# EAGLE design sample_holder (EAGLE 9.3.0)
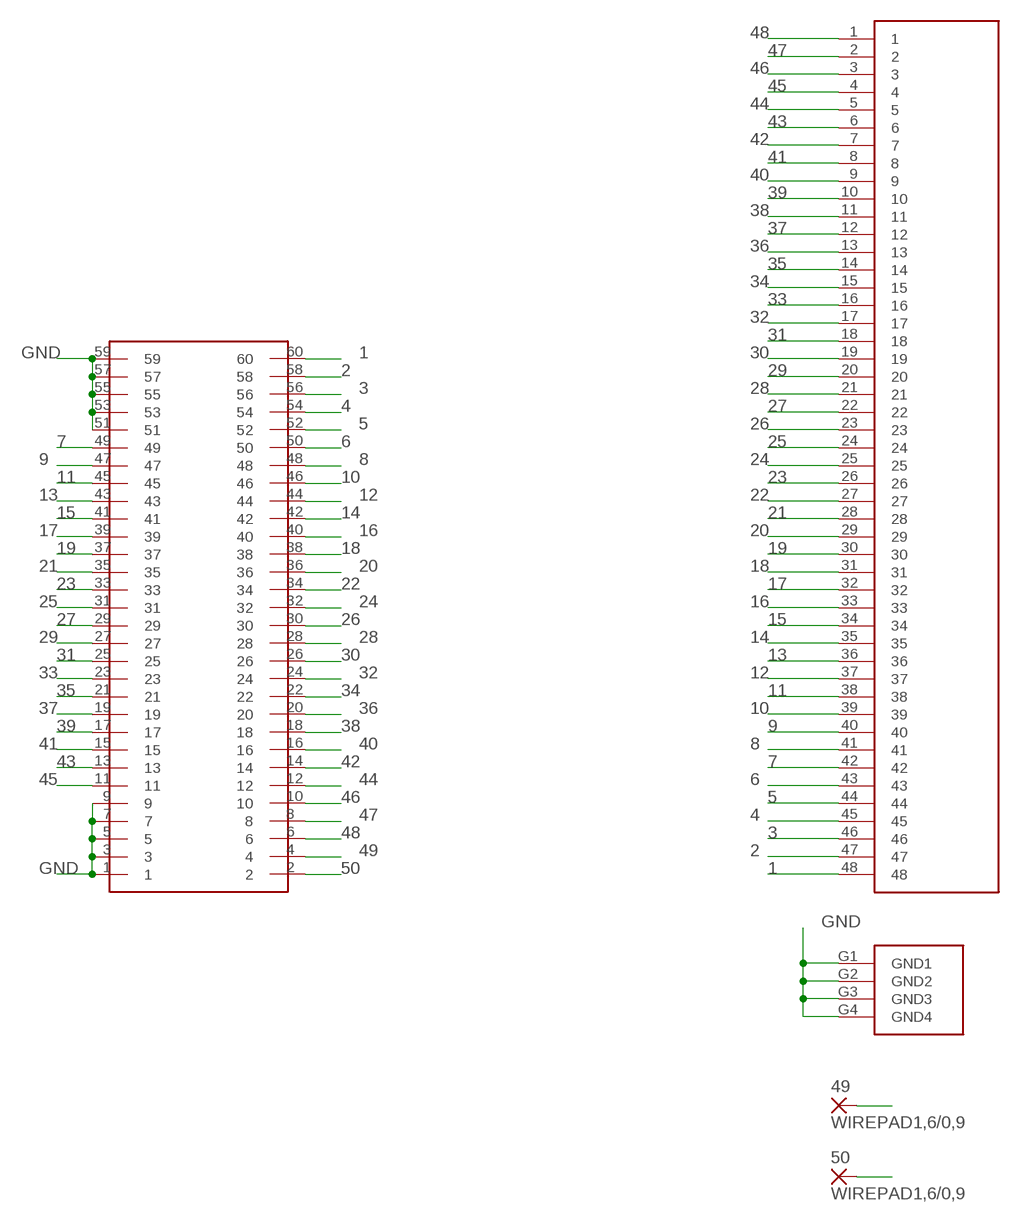
[diagram p0: schematic, sheet 1]

## Parts
49  WIREPAD1,6/0,9  [1,6/0,9]
50  WIREPAD1,6/0,9  [1,6/0,9]
U$1  MEC5-030-CARD-ALL  [MEC-030-CARD-ALL]
U$2  FOLKLAB-48PADS  [FOLKLAB-48PADS]

## Nets
1: U$1.60 U$2.48
2: U$1.58 U$2.47
3: U$1.56 U$2.46
4: U$1.54 U$2.45
5: U$1.52 U$2.44
6: U$1.50 U$2.43
7: U$1.49 U$2.42
8: U$1.48 U$2.41
9: U$1.47 U$2.40
10: U$1.46 U$2.39
11: U$1.45 U$2.38
12: U$1.44 U$2.37
13: U$1.43 U$2.36
14: U$1.42 U$2.35
15: U$1.41 U$2.34
16: U$1.40 U$2.33
17: U$1.39 U$2.32
18: U$1.38 U$2.31
19: U$1.37 U$2.30
20: U$1.36 U$2.29
21: U$1.35 U$2.28
22: U$1.34 U$2.27
23: U$1.33 U$2.26
24: U$1.32 U$2.25
25: U$1.31 U$2.24
26: U$1.30 U$2.23
27: U$1.29 U$2.22
28: U$1.28 U$2.21
29: U$1.27 U$2.20
30: U$1.26 U$2.19
31: U$1.25 U$2.18
32: U$1.24 U$2.17
33: U$1.23 U$2.16
34: U$1.22 U$2.15
35: U$1.21 U$2.14
36: U$1.20 U$2.13
37: U$1.19 U$2.12
38: U$1.18 U$2.11
39: U$1.17 U$2.10
40: U$1.16 U$2.9
41: U$1.15 U$2.8
42: U$1.14 U$2.7
43: U$1.13 U$2.6
44: U$1.12 U$2.5
45: U$1.11 U$2.4
46: U$1.10 U$2.3
47: U$1.8 U$2.2
48: U$1.6 U$2.1
49: 49.1(P) U$1.4
50: 50.1(P) U$1.2
GND: U$1.1 U$1.3 U$1.5 U$1.7 U$1.9 U$1.51 U$1.53 U$1.55 U$1.57 U$1.59 U$2.G1(GND1) U$2.G2(GND2) U$2.G3(GND3) U$2.G4(GND4)

## Library data of the parts
49 50 = wirepad:WIREPAD: Wire PAD connect wire on PCB
U$1 = MEC5-030-01-L-RA-CARD:MEC5-030-CARD-ALL
U$2 = FolkLab-48pads:FOLKLAB-48PADS

## Net classes
0 default: width 0.152 mm, clearance 0.152 mm

## Board
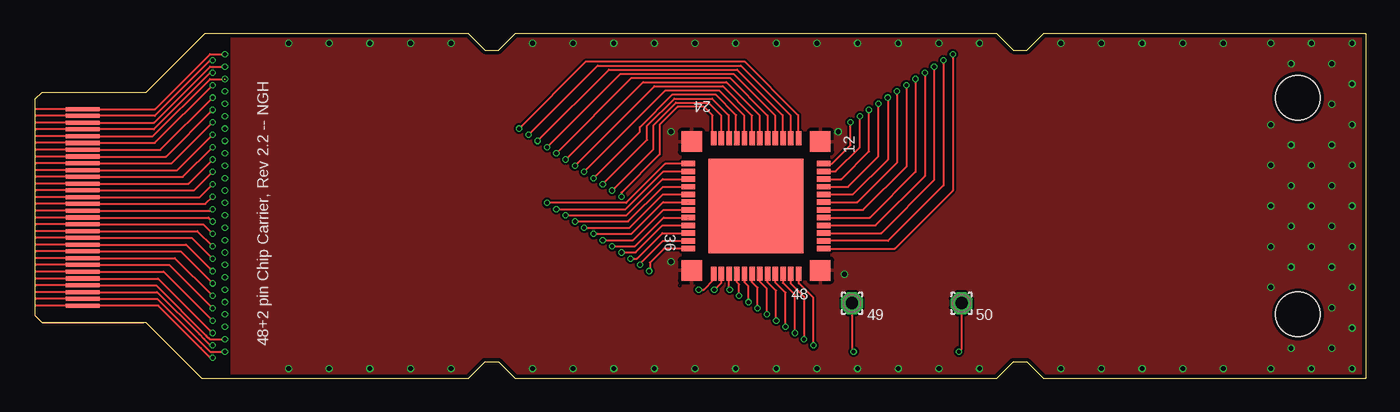
[diagram p1: board, top side]
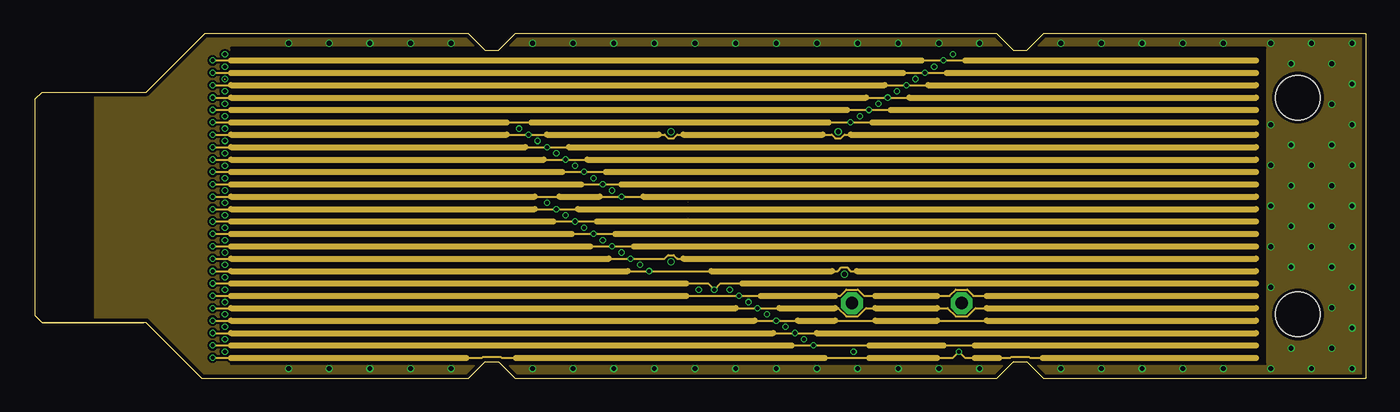
[diagram p2: board, inner layer Route2]
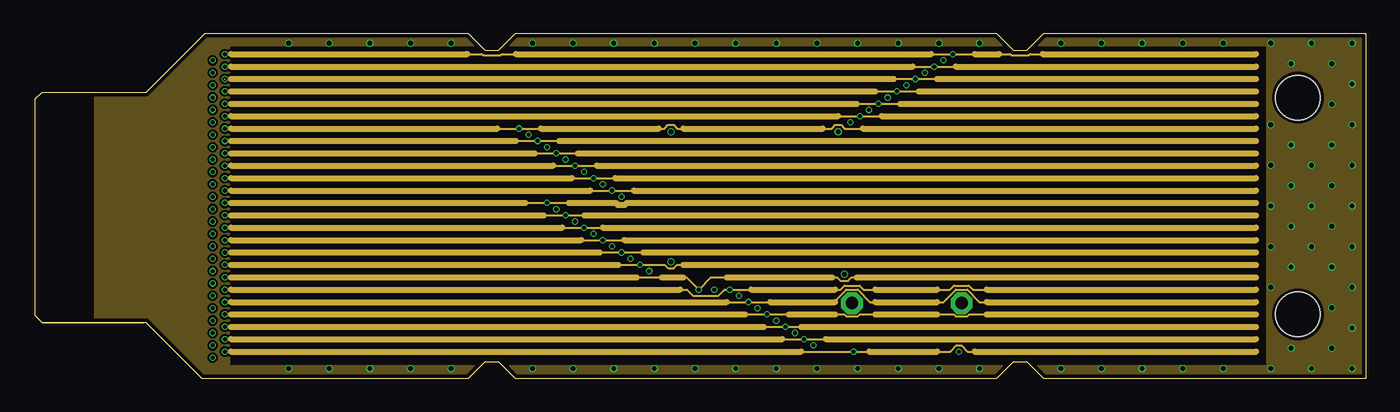
[diagram p3: board, inner layer Route15]
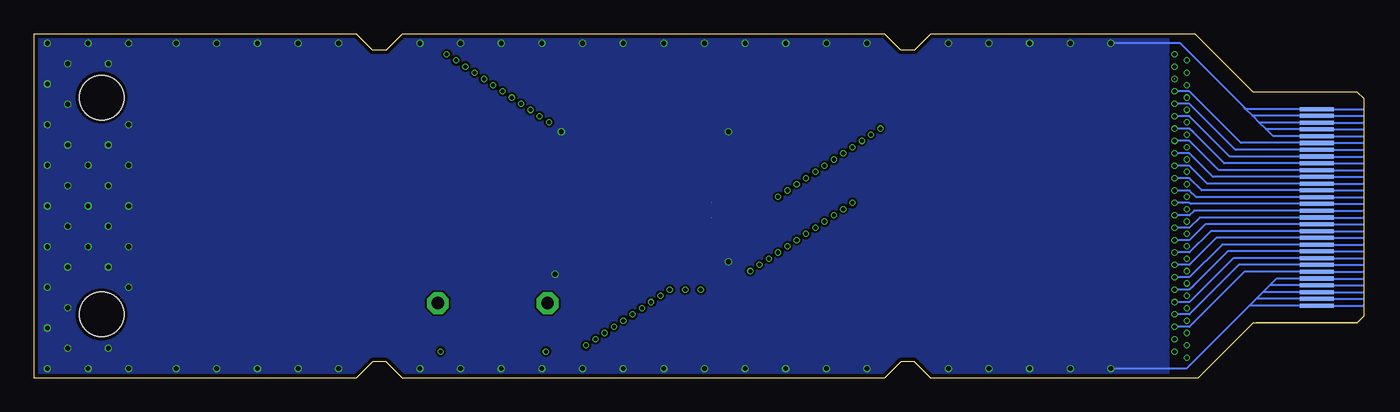
[diagram p4: board, bottom side, seen from below]

Size 98.2 x 25.4 mm. Coordinates in mm from the lower left corner, seen from the top.
Outline: 98.2,25.4 98.2,0 74.4,0 73.2,1.2 72.2,1.2 71,0 35.4,0 34.2,1.2 33.2,1.2 32,0 12.3,0 8.2,4.1 0.5,4.1 0,4.6 0,20.6 0.5,21.1 8.2,21.1 12.5,25.4 32,25.4 33.2,24.2 34.2,24.2 35.4,25.4 71,25.4 72.2,24.2 73.2,24.2 74.4,25.4 98.2,25.4
Copper layers ((1*2)+(15*16)): Top 0.035mm / dielectric 0.2mm / Route2 0.035mm / dielectric 0.4mm / Route15 0.035mm / dielectric 0.2mm / Bottom 0.035mm
Design rules "default *": minimum track width 6mil, minimum drill 10mil, track to track 6mil, track to pad 6mil, pad to pad 6mil, via to via 6mil, smd to smd 6mil, copper to edge 10mil, drill to drill 10mil, minimum pad ring 5mil, minimum via ring 3mil, stop-mask expansion 4mil, vias tented up to drill 12mil, thermal gap 10mil
Holes 3.3 mm at 93.2,4.7 93.2,20.7

### Footprints (pad centres in the part's own frame; a part is rotated, then mirrored left to right if it is on the bottom)
1,6/0,9 = drill 0.914 pad 1.6 octagon: 1 0,0
MEC-030-CARD-ALL = smd 0.3 x 2.5 bottom: 1 -7.25,-3.5; 3 -6.75,-3.5; 5 -6.25,-3.5; 7 -5.75,-3.5; 9 -5.25,-3.5; 11 -4.75,-3.5; 13 -4.25,-3.5; 15 -3.75,-3.5; 17 -3.25,-3.5; 19 -2.75,-3.5; 21 -2.25,-3.5; 23 -1.75,-3.5; 25 -1.25,-3.5; 27 -0.75,-3.5; 29 -0.25,-3.5; 31 0.25,-3.5; 33 0.75,-3.5; 35 1.25,-3.5; 37 1.75,-3.5; 39 2.25,-3.5; 41 2.75,-3.5; 43 3.25,-3.5; 45 3.75,-3.5; 47 4.25,-3.5; 49 4.75,-3.5; 51 5.25,-3.5; 53 5.75,-3.5; 55 6.25,-3.5; 57 6.75,-3.5; 59 7.25,-3.5 | smd 0.3 x 2.5: 2 -7.25,-3.5; 4 -6.75,-3.5; 6 -6.25,-3.5; 8 -5.75,-3.5; 10 -5.25,-3.5; 12 -4.75,-3.5; 14 -4.25,-3.5; 16 -3.75,-3.5; 18 -3.25,-3.5; 20 -2.75,-3.5; 22 -2.25,-3.5; 24 -1.75,-3.5; 26 -1.25,-3.5; 28 -0.75,-3.5; 30 -0.25,-3.5; 32 0.25,-3.5; 34 0.75,-3.5; 36 1.25,-3.5; 38 1.75,-3.5; 40 2.25,-3.5; 42 2.75,-3.5; 44 3.25,-3.5; 46 3.75,-3.5; 48 4.25,-3.5; 50 4.75,-3.5; 52 5.25,-3.5; 54 5.75,-3.5; 56 6.25,-3.5; 58 6.75,-3.5; 60 7.25,-3.5
FOLKLAB-48PADS = smd 7 x 7: 0 0,0 | smd 1 x 0.4: 1 -5,-3.14; 2 -5,-2.57; 3 -5,-2; 4 -5,-1.43; 5 -5,-0.86; 6 -5,-0.29; 7 -5,0.28; 8 -5,0.85; 9 -5,1.42; 10 -5,1.99; 11 -5,2.56; 12 -5,3.13; 25 5,3.13; 26 5,2.56; 27 5,1.99; 28 5,1.42; 29 5,0.85; 30 5,0.28; 31 5,-0.29; 32 5,-0.86; 33 5,-1.43; 34 5,-2; 35 5,-2.57; 36 5,-3.14 | smd 0.4 x 1: 13 -3.14,5; 14 -2.57,5; 15 -2,5; 16 -1.43,5; 17 -0.86,5; 18 -0.29,5; 19 0.28,5; 20 0.85,5; 21 1.42,5; 22 1.99,5; 23 2.56,5; 24 3.13,5; 37 3.13,-5; 38 2.56,-5; 39 1.99,-5; 40 1.42,-5; 41 0.85,-5; 42 0.28,-5; 43 -0.29,-5; 44 -0.86,-5; 45 -1.43,-5; 46 -2,-5; 47 -2.57,-5; 48 -3.14,-5 | smd 1.5 x 1.5: G1 -4.75,-4.75; G2 -4.75,4.75; G3 4.75,4.75; G4 4.75,-4.75

### Placement (x,y rotation side)
49  60.29,5.53 0 top
50  68.37,5.53 0 top
U$1  0,12.6 90 top
U$2  53.2,12.7 90 top

### Tracks (layer width: path | path; a pad name or v marks a point on that pad's centre or on a via)
1  (via drill 0.3 pad 0.08)
  Top 0.152: v14,23.9 12.9,23.9 8.85,19.85 U$1.60 | U$2.48 63.44,9.56 67.72,13.84 v67.72,23.9
  Route15 0.152: v14,23.9 14.46,23.9 | 14.46,23.9 | 66.12,23.9 v67.72,23.9 69.32,23.9 | 31.83,23.9 32.98,23.9 33.05,23.83 34.35,23.83 34.42,23.9 35.49,23.9 | 71.15,23.9 71.98,23.9 72.05,23.83 73.35,23.83 73.42,23.9 74.35,23.9
  Route15 0.457: 14.46,23.9 31.83,23.9 31.91,23.9 | 35.49,23.9 66.12,23.9 | 69.32,23.9 71.15,23.9 | 74.35,23.9 90.12,23.9
2  (via drill 0.3 pad 0.08)
  Top 0.152: U$2.47 62.94,10.13 67.04,14.22 v67.04,23.44 | U$1.58 8.83,19.35 12.93,23.44 v13.09,23.44
  Route2 0.152: v13.09,23.44 14.46,23.44 | 65.44,23.44 v67.04,23.44 68.64,23.44
  Route2 0.457: 14.46,23.44 65.44,23.44 | 68.64,23.44 90.12,23.44
3  (via drill 0.3 pad 0.08)
  Top 0.152: v14,22.99 v14,22.98 12.9,22.98 8.76,18.85 U$1.56 | U$2.46 62.45,10.7 66.35,14.6 v66.35,22.99
  Route15 0.152: v14,22.99 14.46,22.99 | 64.75,22.99 v66.35,22.99 67.95,22.99
  Route15 0.457: 14.46,22.99 64.75,22.99 | 67.95,22.99 90.12,22.99
4  (via drill 0.3 pad 0.08)
  Top 0.152: U$2.45 62.03,11.27 65.67,14.91 v65.67,22.53 | U$1.54 8.75,18.35 12.93,22.53 v13.09,22.53
  Route2 0.152: v13.09,22.53 14.46,22.53 | 64.06,22.53 v65.67,22.53 67.27,22.53
  Route2 0.457: 14.46,22.53 64.06,22.53 | 67.27,22.53 90.12,22.53
5  (via drill 0.3 pad 0.08)  (1 unrouted)
  Top 0.152: v14,22.07 12.9,22.07 8.68,17.85 U$1.52 | U$2.44 61.61,11.84 64.98,15.21 v64.98,22.07
  Route15 0.152: v14,22.07 14.46,22.07 | 63.38,22.07 v64.98,22.07 66.58,22.07
  Route15 0.457: 14.46,22.07 63.38,22.07 | 66.58,22.07 90.12,22.07
6  (via drill 0.3 pad 0.08)
  Top 0.152: U$2.43 61.11,12.41 64.29,15.6 v64.29,21.61 | U$1.50 8.82,17.35 v13.09,21.61
  Route2 0.152: v13.09,21.61 14.46,21.61 | 62.69,21.61 v64.29,21.61 65.89,21.61
  Route2 0.457: 14.46,21.61 62.69,21.61 | 65.89,21.61 90.12,21.61
7  (via drill 0.3 pad 0.08)
  Top 0.152: U$2.42 60.69,12.98 63.61,15.9 v63.61,21.16
  Route15 0.152: v14,21.16 14.46,21.16 | 62.01,21.16 v63.61,21.16 65.21,21.16
  Route15 0.457: 14.46,21.16 62.01,21.16 | 65.21,21.16 90.12,21.16
  Bottom 0.152: v14,21.16 12.9,21.16 12.63,20.89 9.09,17.35 U$1.49
8  (via drill 0.3 pad 0.08)
  Top 0.152: U$2.41 60.34,13.55 62.92,16.13 v62.92,20.7 | U$1.48 9.24,16.85 v13.09,20.7
  Route2 0.152: v13.09,20.7 14.46,20.7 | 61.32,20.7 v62.92,20.7 64.52,20.7
  Route2 0.457: 14.46,20.7 61.32,20.7 | 64.52,20.7 90.12,20.7
9  (via drill 0.3 pad 0.08)
  Top 0.152: U$2.40 60,14.12 62.24,16.36 v62.24,20.24
  Route15 0.152: v14,20.24 14.46,20.24 | 60.64,20.24 v62.24,20.24 63.84,20.24
  Route15 0.457: 14.46,20.24 60.64,20.24 | 63.84,20.24 90.12,20.24
  Bottom 0.152: v14,20.24 12.9,20.24 9.51,16.85 U$1.47
10  (via drill 0.3 pad 0.08)
  Top 0.152: U$2.39 59.5,14.69 61.55,16.74 v61.55,19.79 | U$1.46 9.65,16.35 v13.09,19.79
  Route2 0.152: v13.09,19.79 14.46,19.79 | 59.95,19.79 v61.55,19.79 63.15,19.79
  Route2 0.457: 14.46,19.79 59.95,19.79 | 63.15,19.79 90.12,19.79
11  (via drill 0.3 pad 0.08)
  Top 0.152: U$2.38 59.08,15.26 60.87,17.04 v60.87,19.33
  Route15 0.152: v14,19.33 14.46,19.33 | 59.26,19.33 v60.87,19.33 62.47,19.33
  Route15 0.457: 14.46,19.33 59.26,19.33 | 62.47,19.33 90.12,19.33
  Bottom 0.152: v14,19.33 12.9,19.33 9.92,16.35 U$1.45
12  (via drill 0.3 pad 0.08)
  Top 0.152: U$2.37 58.81,15.83 60.18,17.2 v60.18,18.87 | U$1.44 10.06,15.85 v13.09,18.87
  Route2 0.152: v13.09,18.87 14.46,18.87 | 34.8,18.87 36.63,18.87 | 58.58,18.87 v60.18,18.87 61.78,18.87
  Route2 0.457: 14.46,18.87 34.8,18.87 | 36.63,18.87 58.58,18.87 | 61.78,18.87 90.12,18.87
13  (via drill 0.3 pad 0.08)
  Top 0.152: v35.72,18.41 40.67,23.37 52.34,23.37 56.3,19.41 56.3,17.74 U$2.36
  Route15 0.152: v14,18.41 14.46,18.41 | 34.12,18.41 v35.72,18.41 37.32,18.41 | 46.01,18.41 46.45,18.41 46.72,18.68 47.12,18.68 47.39,18.41 47.83,18.41 | 58.12,18.41 58.8,18.41 59.06,18.68 59.47,18.68 59.73,18.41 61.09,18.41
  Route15 0.457: 14.46,18.41 34.12,18.41 | 37.32,18.41 46.01,18.41 | 47.83,18.41 58.12,18.41 | 61.09,18.41 90.12,18.41
  Bottom 0.152: v14,18.41 12.9,18.41 12.63,18.15 12.63,18.14 10.34,15.85 U$1.43
14  (via drill 0.3 pad 0.08)
  Top 0.152: v36.4,17.96 41.51,23.06 52.07,23.06 55.73,19.41 55.73,17.74 U$2.35 | U$1.42 10.48,15.35 v13.09,17.96
  Route2 0.152: v13.09,17.96 14.46,17.96 | 34.8,17.96 v36.4,17.96 37.78,17.96 38.01,17.96 | 46.01,17.96 46.45,17.96 46.72,17.7 47.12,17.7 47.39,17.96 47.83,17.96 | 58.12,17.96 58.8,17.96 59.06,17.7 59.47,17.7 59.73,17.96 60.18,17.96
  Route2 0.457: 14.46,17.96 34.8,17.96 | 37.78,17.96 46.01,17.96 | 47.83,17.96 58.12,17.96 | 60.18,17.96 90.12,17.96
15  (via drill 0.3 pad 0.08)
  Top 0.152: v37.09,17.5 42.35,22.76 51.81,22.76 55.16,19.41 55.16,17.74 U$2.34
  Top 0.203: U$2.34 55.24,17.74
  Route15 0.152: v14,17.5 14.46,17.5 | 35.49,17.5 v37.09,17.5 38.69,17.5
  Route15 0.457: 14.46,17.5 35.49,17.5 | 38.69,17.5 90.12,17.5
  Bottom 0.152: v14,17.5 12.9,17.5 12.63,17.23 10.75,15.35 U$1.41
16  (via drill 0.3 pad 0.08)
  Top 0.152: v37.78,17.04 43.19,22.45 51.54,22.45 54.59,19.41 54.59,17.74 U$2.33 | U$1.40 10.89,14.85 v13.09,17.04
  Route2 0.152: v13.09,17.04 14.46,17.04 | 36.18,17.04 v37.78,17.04 39.38,17.04
  Route2 0.457: 14.46,17.04 36.18,17.04 | 39.38,17.04 90.12,17.04
17  (via drill 0.3 pad 0.08)
  Top 0.152: v38.46,16.59 44.02,22.15 51.28,22.15 54.06,19.37 U$2.32
  Route15 0.152: v14,16.59 14.46,16.59 | 36.86,16.59 v38.46,16.59 40.06,16.59
  Route15 0.457: 14.46,16.59 36.86,16.59 | 40.06,16.59 90.12,16.59
  Bottom 0.152: v14,16.59 v14,16.58 12.9,16.58 11.16,14.85 U$1.39
18  (via drill 0.3 pad 0.08)
  Top 0.152: v39.15,16.13 44.86,21.84 51.01,21.84 53.45,19.41 53.45,17.74 U$2.31 | U$1.38 11.31,14.35 v13.09,16.13
  Route2 0.152: v13.09,16.13 14.46,16.13 | 37.55,16.13 v39.15,16.13 40.75,16.13
  Route2 0.457: 14.46,16.13 37.55,16.13 | 40.75,16.13 90.12,16.13
19  (via drill 0.3 pad 0.08)
  Top 0.152: v39.83,15.67 45.7,21.54 50.75,21.54 52.92,19.37 U$2.30
  Route15 0.152: v14,15.67 14.46,15.67 | 38.23,15.67 v39.83,15.67 41.43,15.67
  Route15 0.457: 14.46,15.67 38.23,15.67 | 41.43,15.67 90.12,15.67
  Bottom 0.152: v14,15.67 12.9,15.67 11.58,14.35 U$1.37
20  (via drill 0.3 pad 0.08)
  Top 0.152: v40.52,15.21 46.54,21.23 50.48,21.23 52.31,19.41 52.31,17.74 U$2.29 | U$1.36 11.72,13.85 v13.09,15.21
  Route2 0.152: v13.09,15.21 14.46,15.21 | 38.92,15.21 v40.52,15.21 42.12,15.21
  Route2 0.457: 14.46,15.21 38.92,15.21 | 42.12,15.21 90.12,15.21
21  (via drill 0.3 pad 0.08)
  Top 0.152: v41.21,14.76 44.63,18.19 44.63,18.52 47.04,20.93 50.22,20.93 51.74,19.41 51.74,17.74 U$2.28
  Route15 0.152: v14,14.76 14.46,14.76 | 39.61,14.76 v41.21,14.76 42.8,14.76
  Route15 0.457: 14.46,14.76 39.61,14.76 | 42.8,14.76 90.12,14.76
  Bottom 0.152: v14,14.76 v14,14.75 12.9,14.75 11.99,13.85 U$1.35
22  (via drill 0.3 pad 0.08)
  Top 0.152: v41.89,14.3 45.17,17.58 45.17,18.62 47.17,20.62 49.95,20.62 51.17,19.41 51.17,17.74 U$2.27 | U$1.34 12.14,13.35 v13.09,14.3
  Route2 0.152: v13.09,14.3 14.46,14.3 | 40.29,14.3 v41.89,14.3 43.26,14.3 43.49,14.3
  Route2 0.457: 14.46,14.3 40.29,14.3 | 43.26,14.3 90.12,14.3
23  (via drill 0.3 pad 0.08)
  Top 0.152: v42.58,13.84 45.62,16.89 45.62,18.65 47.29,20.32 49.69,20.32 50.6,19.41 50.6,17.74 U$2.26
  Top 0.203: 50.59,17.75 U$2.26
  Route15 0.152: v14,13.84 14.46,13.84 | 40.98,13.84 v42.58,13.84 44.18,13.84
  Route15 0.457: 14.46,13.84 40.98,13.84 | 44.18,13.84 90.12,13.84
  Bottom 0.152: v14,13.84 13.6,13.84 12.9,13.84 12.41,13.35 U$1.33
24  (via drill 0.3 pad 0.08)
  Top 0.152: U$2.25 50,17.77 50,19.38 49.37,20.02 47.42,20.02 46.08,18.68 46.08,16.51 43.26,13.69 v43.26,13.39 | U$1.32 12.55,12.85 v13.09,13.39
  Route2 0.152: v13.09,13.39 14.46,13.39 | 36.86,13.39 38.69,13.39 | 41.66,13.39 v43.26,13.39 44.86,13.39
  Route2 0.457: 14.46,13.39 36.86,13.39 | 38.69,13.39 41.66,13.39 | 44.86,13.39 90.12,13.39
25  (via drill 0.3 pad 0.08)
  Top 0.152: U$2.24 48.18,15.81 46.49,15.81 43.61,12.93 v37.78,12.93
  Route15 0.152: v14,12.93 14.46,12.93 | 36.18,12.93 v37.78,12.93 39.38,12.93
  Route15 0.457: 14.46,12.93 36.18,12.93 | 39.38,12.93 42.86,12.93 43.01,12.78 43.51,12.78 43.66,12.93 90.12,12.93
  Bottom 0.152: v14,12.93 13.4,12.93 12.9,12.93 12.82,12.85 U$1.31
26  (via drill 0.3 pad 0.08)
  Top 0.152: v38.46,12.47 43.58,12.47 46.37,15.26 U$2.23 | U$1.30 12.97,12.35 v13.09,12.47
  Route2 0.152: v13.09,12.47 14.46,12.47 | 36.86,12.47 v38.46,12.47 40.06,12.47
  Route2 0.457: 14.46,12.47 36.86,12.47 | 40.06,12.47 90.12,12.47
27  (via drill 0.3 pad 0.08)
  Top 0.152: v39.15,12.01 43.63,12.01 46.31,14.69 U$2.22
  Route15 0.152: v14,12.01 14.46,12.01 | 37.55,12.01 v39.15,12.01 40.52,12.01 40.75,12.01
  Route15 0.457: 14.46,12.01 37.55,12.01 | 40.52,12.01 90.12,12.01
  Bottom 0.152: v14,12.01 13.09,12.01 12.9,12.01 12.56,12.35 U$1.29
28  (via drill 0.3 pad 0.08)
  Top 0.152: v39.83,11.56 43.76,11.56 46.32,14.12 U$2.21 | U$1.28 12.79,11.85 v13.09,11.56
  Route2 0.152: v13.09,11.56 14.46,11.56 | 38.23,11.56 v39.83,11.56 41.43,11.56
  Route2 0.457: 14.46,11.56 38.23,11.56 | 41.43,11.56 90.12,11.56
29  (via drill 0.3 pad 0.08)
  Top 0.152: v40.52,11.1 43.88,11.1 46.33,13.55 U$2.20
  Route15 0.152: v14,11.1 14.46,11.1 | 38.92,11.1 v40.52,11.1 41.89,11.1 42.12,11.1
  Route15 0.457: 14.46,11.1 38.92,11.1 | 41.89,11.1 90.12,11.1
  Bottom 0.152: v14,11.1 12.9,11.1 12.15,11.85 U$1.27
30  (via drill 0.3 pad 0.08)  (1 unrouted)
  Top 0.152: v41.21,10.64 44.01,10.64 46.35,12.98 U$2.19 | U$1.26 12.38,11.35 v13.09,10.64
  Route2 0.152: v13.09,10.64 14.46,10.64 | 39.61,10.64 v41.21,10.64 42.8,10.64
  Route2 0.457: 14.46,10.64 39.61,10.64 | 42.8,10.64 90.12,10.64
31  (via drill 0.3 pad 0.08)
  Top 0.152: v41.89,10.18 44.14,10.18 46.36,12.41 U$2.18
  Route15 0.152: v14,10.18 14.46,10.18 | 40.29,10.18 v41.89,10.18 43.49,10.18
  Route15 0.457: 14.46,10.18 40.29,10.18 | 43.49,10.18 90.12,10.18
  Bottom 0.152: v14,10.18 13.47,10.18 13.47,10.19 12.9,10.19 11.74,11.35 U$1.25
32  (via drill 0.3 pad 0.08)  (1 unrouted)
  Top 0.152: v42.58,9.73 44.26,9.73 46.37,11.84 U$2.17 | U$1.24 11.96,10.85 v13.09,9.73
  Route2 0.152: v13.09,9.73 14.46,9.73 | 40.98,9.73 v42.58,9.73 44.18,9.73
  Route2 0.457: 14.46,9.73 40.98,9.73 | 44.18,9.73 90.12,9.73
33  (via drill 0.3 pad 0.08)
  Top 0.152: U$2.16 46.31,11.27 44.31,9.27 v43.26,9.27
  Route15 0.152: v14,9.27 14.46,9.27 | 41.66,9.27 v43.26,9.27 44.86,9.27
  Route15 0.457: 14.46,9.27 41.66,9.27 | 44.86,9.27 90.12,9.27
  Bottom 0.152: v14,9.27 12.9,9.27 11.32,10.85 U$1.23
34  (via drill 0.3 pad 0.08)
  Top 0.152: U$2.15 46.29,10.7 44.41,8.81 v43.95,8.81 | U$1.22 11.55,10.35 v13.09,8.81
  Route2 0.152: v13.09,8.81 14.46,8.81 | 42.35,8.81 v43.95,8.81 46.45,8.81 46.72,9.08 47.12,9.08 47.39,8.81 47.83,8.81
  Route2 0.457: 14.46,8.81 42.35,8.81 | 47.83,8.81 90.12,8.81
35  (via drill 0.3 pad 0.08)
  Top 0.152: U$2.14 46.33,10.13 44.63,8.43 v44.63,8.36
  Route15 0.152: v14,8.36 14.46,8.36 | 43.03,8.36 v44.63,8.36 v44.64,8.35 46.46,8.35 46.72,8.09 47.12,8.09 47.39,8.36 47.83,8.36
  Route15 0.457: 14.46,8.36 43.03,8.36 | 47.83,8.36 90.12,8.36
  Bottom 0.152: v14,8.36 12.9,8.36 10.91,10.35 U$1.21
36  (via drill 0.3 pad 0.08)
  Top 0.152: v45.32,7.9 45.36,7.94 45.36,8.52 46.4,9.56 U$2.13 | U$1.20 11.14,9.85 v13.09,7.9
  Route2 0.152: v13.09,7.9 14.46,7.9 | 43.72,7.9 v45.32,7.9 49.89,7.9 | 58.81,7.9 59.26,7.9 59.52,8.16 59.93,8.16 60.19,7.9 60.64,7.9
  Route2 0.457: 14.46,7.9 43.72,7.9 | 49.89,7.9 58.81,7.9 | 60.64,7.9 90.12,7.9
37  (via drill 0.3 pad 0.08)
  Top 0.152: U$2.12 50.07,7.25 49.35,6.53 v48.98,6.53
  Route15 0.152: v14,7.44 14.46,7.44 | 44.41,7.44 46.23,7.44 | 58.81,7.44 59.18,7.44 59.44,7.18 60,7.18 60.26,7.44 60.64,7.44 | 47.83,7.44 48.06,7.44 v48.98,6.53 49.89,7.44 51.04,7.44
  Route15 0.457: 14.46,7.44 44.41,7.44 | 46.23,7.44 47.83,7.44 | 51.04,7.44 58.81,7.44 | 60.64,7.44 90.12,7.44
  Bottom 0.152: v14,7.44 12.9,7.44 10.49,9.85 U$1.19
38  (via drill 0.3 pad 0.08)
  Top 0.152: v50.12,6.53 50.64,7.05 U$2.11 | U$1.18 10.72,9.35 v13.09,6.98
  Route2 0.152: v13.09,6.98 14.46,6.98 | 48.06,6.98 49.66,6.98 v50.12,6.53 50.58,6.98 52.18,6.98
  Route2 0.457: 14.46,6.98 48.06,6.98 | 52.18,6.98 90.12,6.98
39  (via drill 0.3 pad 0.08)
  Top 0.152: v51.26,6.53 51.21,6.58 U$2.10
  Route15 0.152: v14,6.53 14.46,6.53 | 52.86,6.53 v51.26,6.53 50.88,6.53 50.43,6.07 48.56,6.07 48.11,6.53 47.61,6.53 | 59.04,6.53 59.44,6.53 59.75,6.83 60.84,6.83 61.14,6.53 62.01,6.53 | 66.58,6.53 67.52,6.53 67.83,6.83 68.92,6.83 69.22,6.53 70.24,6.53
  Route15 0.457: 14.46,6.53 47.61,6.53 | 52.86,6.53 59.04,6.53 | 62.01,6.53 66.58,6.53 | 70.24,6.53 90.12,6.53
  Bottom 0.152: v14,6.53 12.9,6.53 12.63,6.8 10.08,9.35 U$1.17
40  (via drill 0.3 pad 0.08)
  Top 0.152: v51.95,6.07 51.95,6.91 51.78,7.08 U$2.9 | U$1.16 10.31,8.85 v13.09,6.07
  Route2 0.152: v13.09,6.07 14.46,6.07 | 53.55,6.07 v51.95,6.07 48.06,6.07 | 59.04,6.07 59.42,6.07 59.87,6.53 60.71,6.53 61.17,6.07 62.01,6.07 | 66.58,6.07 67.49,6.07 67.95,6.53 68.79,6.53 69.25,6.07 70.24,6.07
  Route2 0.457: 14.46,6.07 48.06,6.07 | 53.55,6.07 59.04,6.07 | 62.01,6.07 66.58,6.07 | 70.24,6.07 90.12,6.07
41  (via drill 0.3 pad 0.08)
  Top 0.152: U$2.8 52.34,7.08 52.64,6.78 v52.64,5.61
  Route15 0.152: v14,5.61 14.46,5.61 | 51.04,5.61 v52.64,5.61 54.23,5.61 | 59.04,5.61 58.96,5.61 59.87,6.53 60.71,6.53 61.63,5.61 62.01,5.61 | 66.58,5.61 67.04,5.61 67.95,6.53 68.79,6.53 69.7,5.61 70.24,5.61
  Route15 0.457: 14.46,5.61 51.04,5.61 | 54.23,5.61 59.04,5.61 | 62.01,5.61 66.58,5.61 | 70.24,5.61 90.12,5.61
  Bottom 0.152: v14,5.61 v14,5.62 12.9,5.62 9.66,8.85 U$1.15
42  (via drill 0.3 pad 0.08)
  Top 0.152: v53.32,5.16 53.32,6.68 52.92,7.08 U$2.7 | U$1.14 9.89,8.35 v13.09,5.16
  Route2 0.152: v13.09,5.16 14.46,5.16 | 51.72,5.16 v53.32,5.16 54.92,5.16 | 59.04,5.16 59.26,5.16 59.87,4.55 60.71,4.55 61.32,5.16 62.01,5.16 | 66.58,5.16 67.34,5.16 67.95,4.55 68.79,4.55 69.4,5.16 70.24,5.16
  Route2 0.457: 14.46,5.16 51.72,5.16 | 54.92,5.16 59.04,5.16 | 62.01,5.16 66.58,5.16 | 70.24,5.16 90.12,5.16
43  (via drill 0.3 pad 0.08)
  Top 0.152: v54.01,4.7 54.01,6.6 53.47,7.14 53.47,7.68 U$2.6
  Route15 0.152: v14,4.7 14.46,4.7 | 52.41,4.7 v54.01,4.7 55.61,4.7 | 59.04,4.7 59.72,4.7 59.87,4.55 60.71,4.55 60.87,4.7 62.01,4.7 | 66.58,4.7 67.8,4.7 67.95,4.55 68.79,4.55 68.94,4.7 70.24,4.7
  Route15 0.457: 14.46,4.7 52.41,4.7 | 55.61,4.7 59.04,4.7 | 62.01,4.7 66.58,4.7 | 70.24,4.7 90.12,4.7
  Bottom 0.152: v14,4.7 12.9,4.7 9.25,8.35 U$1.13
44  (via drill 0.3 pad 0.08)
  Top 0.152: v54.69,4.24 54.69,6.45 54.06,7.08 U$2.5 | U$1.12 9.48,7.85 v13.09,4.24
  Route2 0.152: v13.09,4.24 14.46,4.24 | 53.09,4.24 v54.69,4.24 56.29,4.24 | 59.04,4.24 62.01,4.24 | 66.58,4.24 70.24,4.24
  Route2 0.457: 14.46,4.24 53.09,4.24 | 56.29,4.24 59.04,4.24 | 62.01,4.24 66.58,4.24 | 70.24,4.24 90.12,4.24
45  (via drill 0.3 pad 0.08)
  Top 0.152: v55.38,3.79 55.38,6.3 54.63,7.05 U$2.4
  Route15 0.152: v14,3.79 14.46,3.79 | 53.78,3.79 v55.38,3.79 56.52,3.79
  Route15 0.457: 14.46,3.79 53.78,3.79 | 56.52,3.79 90.12,3.79
  Bottom 0.152: v14,3.79 12.9,3.79 8.84,7.85 U$1.11
46  (via drill 0.3 pad 0.08)
  Top 0.152: U$2.3 55.19,7.69 55.19,7.03 56.06,6.15 v56.06,3.33 | U$1.10 9.06,7.35 v13.09,3.33
  Route2 0.152: v13.09,3.33 14.46,3.33 | 54.46,3.33 v56.06,3.33 57.66,3.33
  Route2 0.457: 14.46,3.33 54.46,3.33 | 57.66,3.33 90.12,3.33
47  (via drill 0.3 pad 0.08)
  Top 0.152: v14,2.87 12.9,2.87 12.63,3.14 8.92,6.85 U$1.8 | U$2.2 55.76,7.69 55.76,7.01 56.75,6.02 v56.75,2.87
  Route15 0.152: 55.15,2.87 v56.75,2.87 58.35,2.87 | v14,2.87 14.46,2.87 14.54,2.87
  Route15 0.457: 58.35,2.87 90.12,2.87 | 14.46,2.87 55.15,2.87
48  (via drill 0.3 pad 0.08)
  Top 0.152: v57.44,2.41 57.44,5.92 56.37,6.98 56.37,7.67 U$2.1 | U$1.6 8.99,6.35 12.12,3.22 12.47,2.87 12.93,2.41 v13.09,2.41
  Route2 0.152: v13.09,2.41 14.46,2.41 | 55.84,2.41 v57.44,2.41 61.55,2.41 | 67.04,2.41 69.32,2.41
  Route2 0.457: 14.46,2.41 55.84,2.41 | 61.55,2.41 67.04,2.41 | 69.32,2.41 90.12,2.41
49  (via drill 0.3)
  Top 0.152: v14,1.96 12.9,1.96 9.01,5.85 U$1.4 | 49.1 60.29,2.08 v60.41,1.96
  Route15 0.152: v14,1.96 14.46,1.96 14.54,1.96 | 56.52,1.96 v60.41,1.96 61.55,1.96 | 66.58,1.96 67.54,1.96 67.99,2.41 68.37,2.41 68.82,1.96 69.32,1.96 69.4,1.96
  Route15 0.457: 14.46,1.96 56.52,1.96 | 61.55,1.96 66.58,1.96 | 69.32,1.96 90.12,1.96
50  (via drill 0.3)
  Top 0.152: 50.1 68.37,2.15 v68.18,1.96 | U$1.2 9.08,5.35 12.21,2.21 12.37,2.05 12.93,1.5 v13.09,1.5
  Route2 0.152: v13.09,1.5 14.46,1.5 | 31.83,1.5 32.98,1.5 33.05,1.57 34.35,1.57 34.42,1.5 35.49,1.5 | 58.27,1.5 61.55,1.5 | 66.58,1.5 67.72,1.5 v68.18,1.96 68.64,1.5 69.32,1.5 | 71.15,1.5 71.98,1.5 72.05,1.57 73.35,1.57 73.42,1.5 74.35,1.5
  Route2 0.457: 14.46,1.5 31.83,1.5 | 35.49,1.5 58.27,1.5 | 61.55,1.5 66.58,1.5 | 69.32,1.5 71.15,1.5 | 74.35,1.5 90.12,1.5
GND  (via drill 0.35, 0.35 pad 0.53)
  Bottom 0.152: v18.7,0.7 13.12,0.7 8.47,5.35 | v18.7,24.7 13.58,24.7 8.89,20.01 8.73,19.85 | U$1.9 6.47,7.35 6.97,6.85 | U$1.7 6.97,6.85 | 6.97,6.85 7.47,6.35 | U$1.5 7.47,6.35 | 7.47,6.35 7.97,5.85 | U$1.3 7.97,5.85 | 7.97,5.85 8.47,5.35 | U$1.1 8.47,5.35 | U$1.51 6.73,17.85 7.23,18.35 | 7.73,18.85 8.23,19.35 | 8.23,19.35 8.73,19.85 | U$1.53 7.23,18.35 | 7.23,18.35 7.73,18.85 | U$1.55 7.73,18.85 | U$1.57 8.23,19.35 | U$1.59 8.73,19.85
  other vias: 92.7,17.2 92.7,14.2 92.7,11.2 92.7,8.2 91.2,9.7 91.2,12.7 91.2,15.7 21.7,0.7 24.7,0.7 27.7,0.7 30.7,0.7 36.7,0.7 39.7,0.7 42.7,0.7 45.7,0.7 48.7,0.7 51.7,0.7 57.7,0.7 60.7,0.7 63.7,0.7 69.7,0.7 75.7,0.7 78.7,0.7 81.7,0.7 84.7,0.7 87.7,0.7 87.7,24.7 84.7,24.7 81.7,24.7 78.7,24.7 75.7,24.7 69.7,24.7 60.7,24.7 57.7,24.7 54.7,24.7 51.7,24.7 48.7,24.7 45.7,24.7 42.7,24.7 39.7,24.7 36.7,24.7 30.7,24.7 27.7,24.7 24.7,24.7 21.7,24.7 94.2,15.7 97.2,15.7 95.7,14.2 94.2,12.7 94.2,9.7 91.2,6.7 91.2,18.7 97.2,18.7 95.7,17.2 95.7,11.2 95.7,8.2 97.2,9.7 97.2,6.7 91.2,0.7 94.2,0.7 97.2,0.7 95.7,2.2 92.7,2.2 97.2,3.7 95.7,5.2 97.2,12.7 95.7,20.2 97.2,21.7 95.7,23.2 92.7,23.2 94.2,24.7 91.2,24.7 97.2,24.7 63.7,24.7 66.7,24.7 66.7,0.7 46.92,18.19 46.92,8.59 59.72,7.67 59.26,18.19 54.7,0.7
  pour Top: 14.46,25.96 14.46,-0.56 98.58,-0.56 98.58,25.96
  pour Bottom: 14.46,25.96 14.46,-0.56 98.58,-0.56 98.58,25.96
  pour Route2: 4.4,-0.56 98.58,-0.56 98.58,25.96 4.4,25.96
  pour Route15: 4.4,-0.56 98.58,-0.56 98.58,25.96 4.4,25.96
N$1
  cutout Route2: 14.46,24.36 14.46,1.04 90.81,1.04 90.81,24.36
N$2
  cutout Route15: 14.46,24.36 14.46,1.04 90.81,1.04 90.81,24.36

### Text on the board
tPlace: 24 | 12 | 36 | 48 | 48+2 pin Chip Carrier, Rev 2.2 -- NGH